# Altium schematic sheet SKQGABE010_2025-02-03.schdoc
size 41 x 27 mm
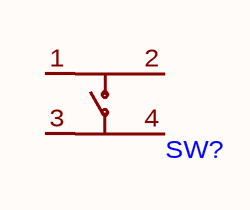
[diagram p0: SKQGABE010_2025-02-03.schdoc]

## Parts
SW?  (no value)  [KEY-SMD_4P-L5.2-W5.2-P3.70-LS6.4]

## Nets

Not connected (* = marked no-connect by the designer): SW? 1 2 3 4

## Library data of the parts
SW? = SKQGABE010